# EAGLE schematic OBI_SlaveBoard_rev2 (EAGLE 7.1.0)
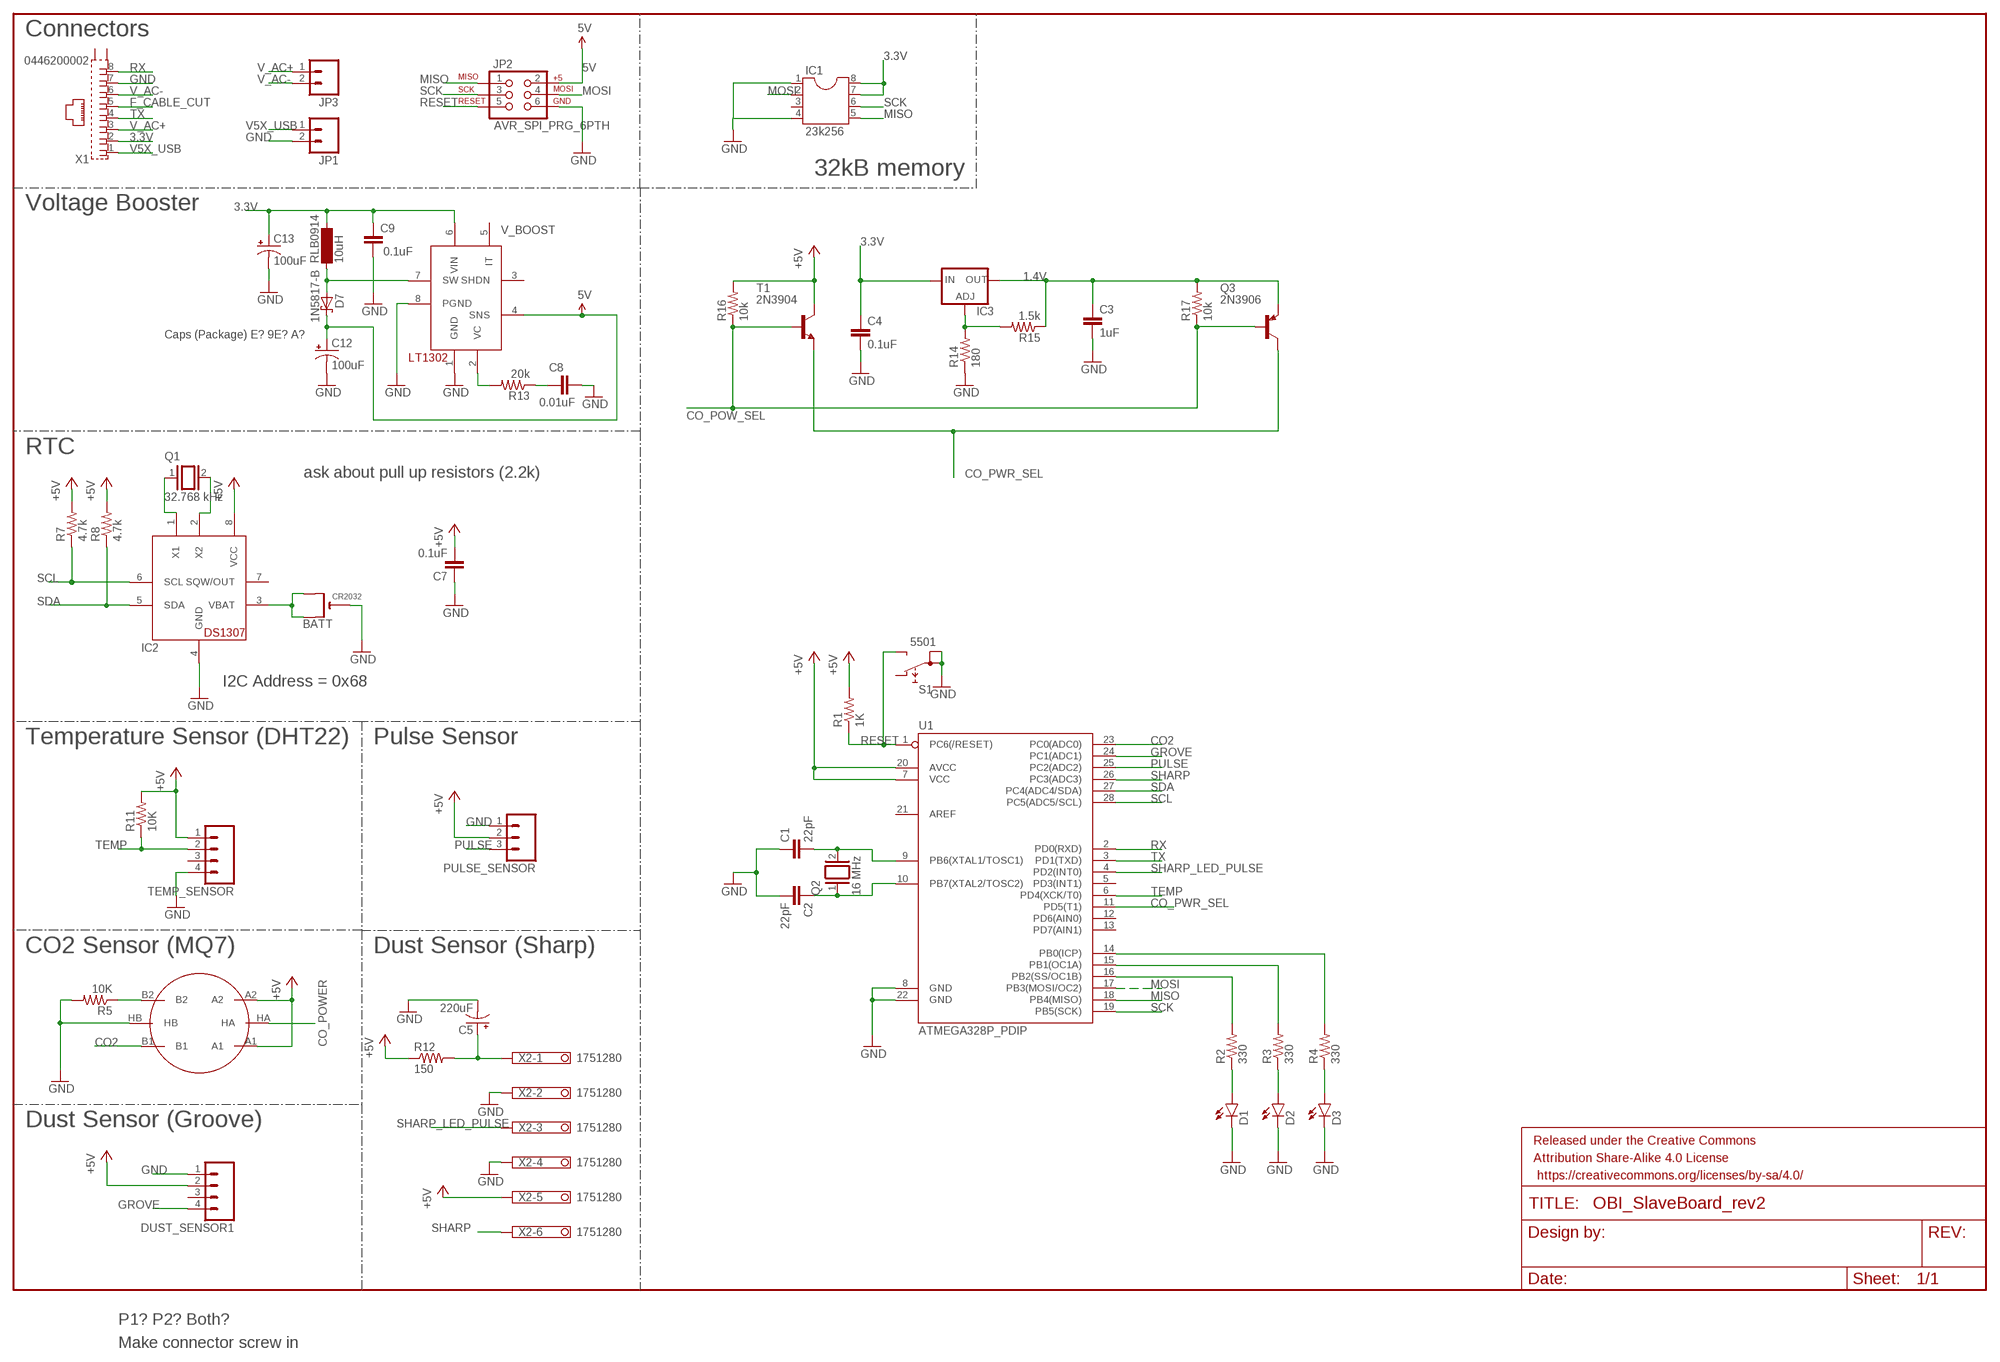
[diagram p0: schematic, sheet 1]

## Parts
BATT  CR2032THM  [CR2032-THRU]
C1  22pF  CAPKIT  [CAP-PTH-SMALL-KIT]
C2  22pF  CAPKIT  [CAP-PTH-SMALL-KIT]
C3  1uF  C-EU025-024X044  [C025-024X044]
C4  0.1uF  C-EU025-024X044  [C025-024X044]
C5  220uF  CAP_POLPTH2  [CPOL-RADIAL-10UF-25V]
C7  0.1uF  CAPKIT  [CAP-PTH-SMALL-KIT]
C8  0.01uF  CAPKIT  [CAP-PTH-SMALL-KIT]
C9  0.1uF  CAPKIT  [CAP-PTH-SMALL-KIT]
C12  100uF  CPOL-USSANYO_9E  [SANYO-OSCON_9E]
C13  100uF  CPOL-USSANYO_9E  [SANYO-OSCON_9E]
CO2_SENSOR  METHANE_SENSOR  [MQ-3]
D1  LED5MM  [LED5MM]
D2  LED5MM  [LED5MM]
D3  LED5MM  [LED5MM]
D7  1N5817-B  [DO41-7.6]
DUST_SENSOR1  M04SCREW  [SCREWTERMINAL-3.5MM-4]
FRAME1  FRAME-LEDGER  [CREATIVE_COMMONS]
IC1  23k256  DIL8  [DIL08]
IC2  DS1307  [DIL08]
IC3  LM317TS  [317TS]
JP1  M023.5MM  [SCREWTERMINAL-3.5MM-2]
JP2  AVR_SPI_PRG_6PTH  [2X3]
JP3  M023.5MM  [SCREWTERMINAL-3.5MM-2]
PULSE_SENSOR  M03-SCREW-5MM  [SCREWTERMINAL-5MM-3]
Q1  32.768 kHz  XTAL/S  [QS]
Q2  16 MHz  XTAL/S  [QS]
Q3  2N3906  [TO92]
R1  1K  RESISTORPTH-1/4W  [AXIAL-0.4]
R2  330  RESISTORPTH-1/4W  [AXIAL-0.4]
R3  330  RESISTORPTH-1/4W  [AXIAL-0.4]
R4  330  RESISTORPTH-1/4W  [AXIAL-0.4]
R5  10K  RESISTORPTH-1/4W  [AXIAL-0.4]
R7  4.7k  RESISTORPTH-1/4W  [AXIAL-0.4]
R8  4.7k  RESISTORPTH-1/4W  [AXIAL-0.4]
R11  10K  RESISTORPTH-1/4W  [AXIAL-0.4]
R12  150  RESISTORPTH-1/4W  [AXIAL-0.4]
R13  20k  RESISTORPTH-1/4W  [AXIAL-0.4]
R14  180  R-US_0204/2V  [0204V]
R15  1.5k  R-US_0204/2V  [0204V]
R16  10k  R-US_0204/2V  [0204V]
R17  10k  R-US_0204/2V  [0204V]
RLB0914  10uH  BS11  [BS11]
S1  5501  [5501]
T1  2N3904  [TO92]
TEMP_SENSOR  M04SCREW  [SCREWTERMINAL-3.5MM-4]
U1  ATMEGA328P_PDIP  [DIL28-3]
V_BOOST  LT1302  [DIL08]
X1  0446200002  [0446200002]
X2  1751280  [1751280]

## Nets
1.4V: C3.1 IC3.2(OUT) Q3.3(E) R15.1 R17.2
3.3V: C4.1 C9.1 C13.+ IC1.7 IC1.8 IC3.3(IN) RLB0914.2 V_BOOST.6(VIN) X1.2
5V: C12.+ D7.C JP2.2 V_BOOST.4(SNS)
+5V: C7.2 CO2_SENSOR.A1 CO2_SENSOR.A2 DUST_SENSOR1.2 IC2.8(VCC) PULSE_SENSOR.2 R1.P$2 R7.P$2 R8.P$2 R11.P$2 R12.P$1 R16.2 T1.1(C) TEMP_SENSOR.1 U1.7(VCC) U1.20(AVCC) X2.5
CO2: CO2_SENSOR.B1 U1.23(PC0(ADC0))
CO_POW_SEL: Q3.2(B) R16.1 R17.1 T1.2(B)
CO_POWER: CO2_SENSOR.HA
CO_PWR_SEL: Q3.1(C) T1.3(E) U1.11(PD5(T1))
F_CABLE_CUT: X1.5
GND: BATT.- C1.1 C2.2 C3.2 C4.2 C5.2(-) C7.1 C8.1 C9.2 C12.- C13.- CO2_SENSOR.HB D1.K(C) D2.K(C) D3.K(C) DUST_SENSOR1.1 IC1.1 IC1.4 IC2.4(GND) JP1.2 JP2.6 PULSE_SENSOR.1 R5.P$2 R14.1 S1.1A S1.1B TEMP_SENSOR.4 U1.8(GND) U1.22(GND) V_BOOST.1(GND) V_BOOST.8(PGND) X1.7 X2.2 X2.4
GROVE: U1.24(PC1(ADC1))
MISO: IC1.5 JP2.1 U1.18(PB4(MISO))
MOSI: IC1.2 JP2.4 U1.17(PB3(MOSI/OC2))
N$1: C5.1(+) R12.P$2 X2.1
N$3: C1.2 Q2.2 U1.9(PB6(XTAL1/TOSC1))
N$4: IC3.1(ADJ) R14.2 R15.2
N$5: BATT.+1(+) BATT.+2(+1) IC2.3(VBAT)
N$6: IC2.1(X1) Q1.1
N$7: IC2.2(X2) Q1.2
N$8: R2.P$2 U1.16(PB2(SS/OC1B))
N$9: D1.A R2.P$1
N$10: R3.P$2 U1.15(PB1(OC1A))
N$11: D2.A R3.P$1
N$12: R4.P$2 U1.14(PB0(ICP))
N$13: D3.A R4.P$1
N$14: R13.P$2 V_BOOST.2(VC)
N$16: C2.1 Q2.1 U1.10(PB7(XTAL2/TOSC2))
N$17: CO2_SENSOR.B2 R5.P$1
N$18: C8.2 R13.P$1
N$22: D7.A RLB0914.1 V_BOOST.7(SW)
PULSE: PULSE_SENSOR.3 U1.25(PC2(ADC2))
RESET: JP2.5 R1.P$1 S1.NO U1.1(PC6(/RESET))
RX: U1.2(PD0(RXD)) X1.8
SCK: IC1.6 JP2.3 U1.19(PB5(SCK))
SCL: IC2.6(SCL) R7.P$1 U1.28(PC5(ADC5/SCL))
SDA: IC2.5(SDA) R8.P$1 U1.27(PC4(ADC4/SDA))
SHARP: U1.26(PC3(ADC3)) X2.6
SHARP_LED_PULSE: U1.4(PD2(INT0)) X2.3
TEMP: R11.P$1 TEMP_SENSOR.2 U1.6(PD4(XCK/T0))
TX: U1.3(PD1(TXD)) X1.4
V5X_USB: JP1.1 X1.1
V_AC+: JP3.1 X1.3
V_AC-: JP3.2 X1.6
Unconnected: DUST_SENSOR1.3 DUST_SENSOR1.4 IC1.3 IC2.7(SQW/OUT) S1.NC TEMP_SENSOR.3 U1.5(PD3(INT1)) U1.12(PD6(AIN0)) U1.13(PD7(AIN1)) U1.21(AREF) V_BOOST.3(SHDN) V_BOOST.5(IT) X1.S@1(S1) X1.S@2(S2)

## Notes on the sheet
- Connectors
- 32kB memory
- Voltage Booster
- Caps (Package) E? 9E? A?
- RTC
- ask about pull up resistors (2.2k)
- I2C Address = 0x68
- Temperature Sensor (DHT22) | Pulse Sensor
- CO2 Sensor (MQ7) | Dust Sensor (Sharp)
- Dust Sensor (Groove)
- P1? P2? Both?
- Make connector screw in

## Library data of the parts
BATT = adafruit:CR2032
C1 C2 C7-C9 = SparkFun-Passives:CAP: Capacitor Standard 0603 ceramic capacitor, and 0.1" leaded capacitor.
C3 C4 = rcl:C-EU: CAPACITOR, European symbol
C5 = SparkFun-Capacitors:CAP_POL: Capacitor Polarized These are standard SMD and PTH capacitors. Normally 10uF, 47uF, and 100uF in electrolytic and tantalum varieties. Always verify the external diameter of the through hole cap, it varies with capacity, voltage, and manufacturer. The EIA devices should be standard.
C12 C13 = rcl:CPOL-US: POLARIZED CAPACITOR, American symbol
CO2_SENSOR = SparkFun-Sensors:METHANE_SENSOR: MQ-4 Methane Gas Sensor SEN-09404
D1-D3 = SparkFun-LED:LED: LEDs Standard schematic elements and footprints for 5mm, 3mm, 1206, and 0603 sized LEDs. 5mm - Spark Fun Electronics SKU : COM-00529 (and others)
D7 = diode:1N581*: 1.0A SCHOTTKY BARRIER RECTIFIER Source: http://www.diodes.com/datasheets/ds23001.pdf
DUST_SENSOR1 TEMP_SENSOR = SparkFun-Connectors:M04: Header 4 Standard 4-pin 0.1" header. Use with straight break away headers (SKU : PRT-00116), right angle break away headers (PRT-00553), swiss pins (PRT-00743), machine pins (PRT-00117), and female headers (PRT-00115). Molex polarized connector foot print use with SKU : PRT-08231 with associated crimp pins and housings. 1MM SMD Version SKU: PRT-10208
FRAME1 = SparkFun-Aesthetics:FRAME-LEDGER: Schematic Frame Standard 11x14 US Ledger frame
IC1 = ic-package:DIL8: Dual In Line / Socket
IC2 = adafruit:DS1307: DS1307 Real time clock (RTC) with battery backup ability. Talk to it via i2c
IC3 = v-reg:LM317TS: VOLTAGE REGULATOR
JP1 JP3 = SparkFun-Connectors:M02: Standard 2-pin 0.1" header. Use with - straight break away headers ( PRT-00116) - right angle break away headers (PRT-00553) - swiss pins (PRT-00743) - machine pins (PRT-00117) - female headers (PRT-00115) Molex polarized connector foot print use with: PRT-08233 with associated crimp pins and housings. 2.54_SCREWTERM for use with PRT-10571. 3.5mm Screw Terminal footprints for PRT-08084 5mm Screw Terminal footprints for use with PRT-08432; PROD_ID: CONN-08399
JP2 = SparkFun-Connectors:AVR_SPI_PRG_6: AVR ISP 6 Pin This is the reduced ISP connector for AVR programming. Common on Arduino. This footprint will take up less PCB space and can be used with a 10-pin to 6-pin adapter such as SKU: BOB-08508 **Special note about "TEST_POINT" package. The stop mask is on the top side, so if you want your programming test points to be on the bottom of your board, make sure to place this package on the bottom side of the board. This also ensure that the orientation to program from the bottom side will be correct.
PULSE_SENSOR = SparkFun-Connectors:M03: Header 3 Standard 3-pin 0.1" header. Use with straight break away headers (SKU : PRT-00116), right angle break away headers (PRT-00553), swiss pins (PRT-00743), machine pins (PRT-00117), and female headers (PRT-00115). Molex polarized connector foot print use with SKU : PRT-08232 with associated crimp pins and housings.; STOREFRONT_ID: PRT-08433
Q1 Q2 = special:XTAL/S: CRYSTAL
Q3 = transistor-pnp:2N3906: PNP Transistor
R1 R5 R7 R8 = SparkFun-Passives:RESISTOR: Resistor Basic schematic elements and footprints for 0603, 1206, and PTH resistors.
R2-R4 R11-R13 = SparkFun-Resistors:RESISTOR: Resistor Basic schematic elements and footprints for 0603, 1206, and PTH resistors.
R14-R17 = rcl:R-US_: RESISTOR, American symbol
RLB0914 = inductor-neosid:BS: INDUCTOR nominal inductance, magnetically screened; OC_FARNELL: unknown; OC_NEWARK: unknown
S1 = switch:55?: PUSHBUTTON SERIES 5500 SWITCHES Source: www.e-switch.com .. 5500.pdf
T1 = transistor:2N3904: NPN TRANSISTOR
U1 = SparkFun-DigitalIC:ATMEGA328P_PDIP: uC used in the Arduino 32kb flash, 1k EEPROM, 2k SRAM This is the through-hole version of this chip.
V_BOOST = adafruit:LT1302
X1 = con-molex:0446200002: RJ-45 INVERTED MODULAR JACK ASSEMBLY WITH RJ-11 KEEPOUT FEATURE Source: Data sheet <http://www.farnell.com/datasheets/73207.pdf> MOLEX 0446200002 BUCHSE, RJ45, GESCHIRMT Source: Farnell <http://de.farnell.com/molex/0446200002/buchse-rj45-geschirmt/dp/9251910?ost=9251910>; MF: MOLEX; MPN: 0446200002; OC_FARNELL: 9251910
X2 = con-phoenix-350:1751280: MKDS 1/ 6-3,5 Printklemme Nennstrom: 10 A Bemessungsspannung: 160 V Raster: 3,5 mm Polzahl: 6 Montageart: Löten Anschlussart: Schraubanschluss Anschlussrichtung vom Leiter zur Platine: 0° Source: http://eshop.phoenixcontact.com .. 1751280.pdf; MPN: 1751280; OC_FARNELL: unknown; OC_NEWARK: 27R1765